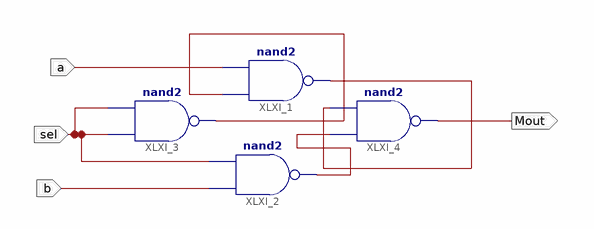
[diagram p0: schematic sheet 1]
// Xilinx ISE schematic oneBitMux.sch (spartan3e) as structural Verilog: 4 symbols, 4 ports
module oneBitMux (
  input  sel,
  input  b,
  input  a,
  output Mout
);

  wire XLXN_3, XLXN_4, XLXN_5;

  nand XLXI_1 (XLXN_4, XLXN_3, a);
  nand XLXI_2 (XLXN_5, b, sel);
  nand XLXI_3 (XLXN_3, sel, sel);
  nand XLXI_4 (Mout, XLXN_5, XLXN_4);
endmodule
